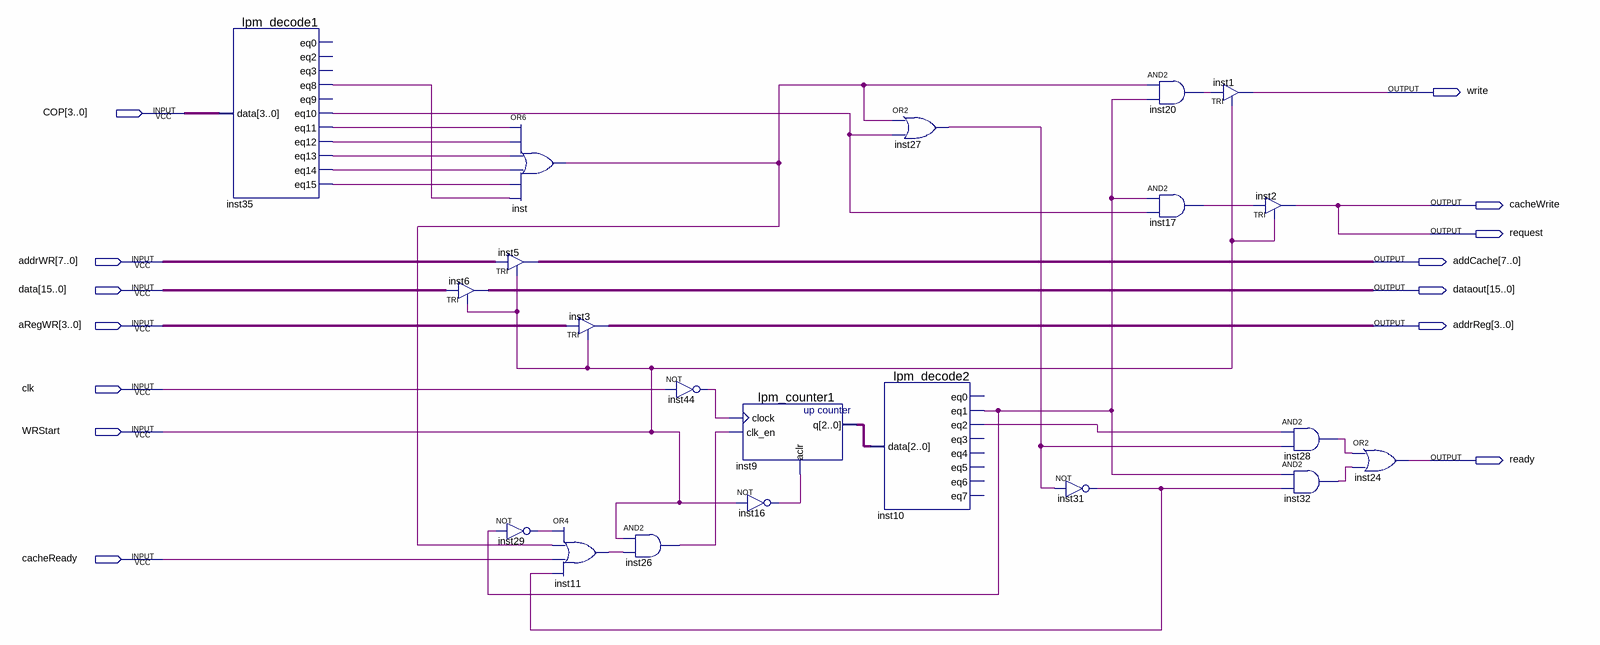
[diagram p0: schematic sheet]
// Quartus schematic WriteResult.bdf as structural Verilog: 21 symbols, 14 pins
module WriteResult (
  input  [3:0] COP,
  input  [7:0] addrWR,
  input  [15:0] data,
  input  [3:0] aRegWR,
  input  clk,
  input  WRStart,
  input  cacheReady,
  output write,
  output cacheWrite,
  output request,
  output [7:0] addCache,
  output [15:0] dataout,
  output [3:0] addrReg,
  output ready
);

  wire inst10_eq1, inst10_eq2, inst11_out, inst16_out, inst17_out, inst20_out, inst26_out, inst27_out,
       inst28_out, inst29_out, inst31_out, inst32_out, inst35_eq8, inst35_eq10, inst35_eq11, inst35_eq12,
       inst35_eq13, inst35_eq14, inst35_eq15, inst44_out, inst_out;
  wire [2:0] inst9_q;

  lpm_decode1 inst35 (
    .data(COP), .eq8(inst35_eq8), .eq10(inst35_eq10), .eq11(inst35_eq11), .eq12(inst35_eq12),
    .eq13(inst35_eq13), .eq14(inst35_eq14), .eq15(inst35_eq15));  // open: eq0, eq2, eq3, eq9
  TRI inst6[15:0] (.IN(data), .OE(WRStart), .OUT(dataout));
  or inst (inst_out, inst35_eq11, inst35_eq12, inst35_eq13, inst35_eq14, inst35_eq15, inst35_eq8);
  TRI inst5[7:0] (.IN(addrWR), .OE(WRStart), .OUT(addCache));
  not inst29 (inst29_out, inst10_eq1);
  TRI inst3[3:0] (.IN(aRegWR), .OE(WRStart), .OUT(addrReg));
  or inst11 (inst11_out, inst29_out, inst_out, cacheReady, inst31_out);
  and inst26 (inst26_out, WRStart, inst11_out);
  not inst44 (inst44_out, clk);
  lpm_counter1 inst9 (.clock(inst44_out), .clk_en(inst26_out), .aclr(inst16_out), .q(inst9_q));
  not inst16 (inst16_out, WRStart);
  lpm_decode2 inst10 (.data(inst9_q), .eq1(inst10_eq1), .eq2(inst10_eq2));  // open: eq0, eq3, eq4, eq5, eq6, eq7
  or inst27 (inst27_out, inst_out, inst35_eq10);
  not inst31 (inst31_out, inst27_out);
  and inst20 (inst20_out, inst_out, inst10_eq1);
  and inst17 (inst17_out, inst10_eq1, inst35_eq10);
  TRI inst1 (.IN(inst20_out), .OE(WRStart), .OUT(write));
  TRI inst2 (.IN(inst17_out), .OE(WRStart), .OUT(cacheWrite));
  and inst28 (inst28_out, inst10_eq2, inst27_out);
  and inst32 (inst32_out, inst10_eq1, inst31_out);
  or inst24 (ready, inst28_out, inst32_out);

  assign request = cacheWrite;
endmodule
